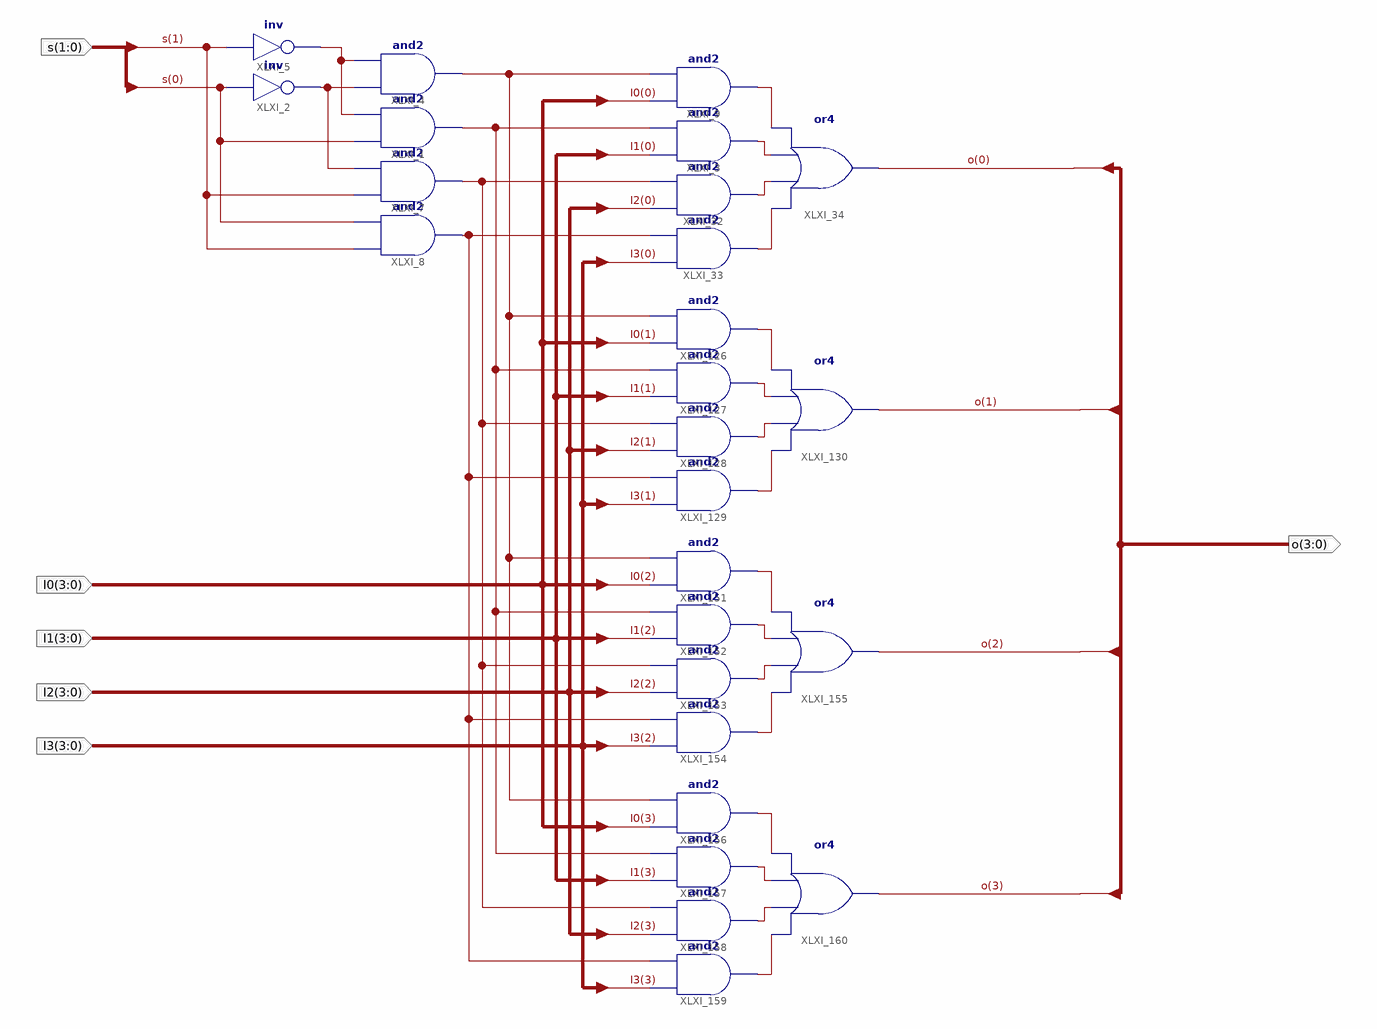
[diagram p0: schematic sheet 1]
// Xilinx ISE schematic MUX441.sch (kintex7) as structural Verilog: 26 symbols, 6 ports
module MUX441 (
  input  [3:0] I2,
  input  [3:0] I0,
  input  [3:0] I1,
  input  [1:0] s,
  input  [3:0] I3,
  output [3:0] o
);

  wire D0, D1, D2, D3, XLXN_40, XLXN_108, XLXN_149, XLXN_150, XLXN_151, XLXN_152, XLXN_390, XLXN_391,
       XLXN_394, XLXN_396, XLXN_440, XLXN_441, XLXN_444, XLXN_446, XLXN_450, XLXN_451, XLXN_454, XLXN_456;

  and XLXI_151 (XLXN_440, I0[2], D0);
  or XLXI_160 (o[3], XLXN_451, XLXN_456, XLXN_454, XLXN_450);
  and XLXI_159 (XLXN_451, I3[3], D3);
  and XLXI_158 (XLXN_456, I2[3], D2);
  and XLXI_157 (XLXN_454, I1[3], D1);
  and XLXI_156 (XLXN_450, I0[3], D0);
  or XLXI_155 (o[2], XLXN_441, XLXN_446, XLXN_444, XLXN_440);
  and XLXI_154 (XLXN_441, I3[2], D3);
  and XLXI_153 (XLXN_446, I2[2], D2);
  and XLXI_152 (XLXN_444, I1[2], D1);
  or XLXI_130 (o[1], XLXN_391, XLXN_396, XLXN_394, XLXN_390);
  and XLXI_129 (XLXN_391, I3[1], D3);
  and XLXI_128 (XLXN_396, I2[1], D2);
  and XLXI_127 (XLXN_394, I1[1], D1);
  and XLXI_126 (XLXN_390, I0[1], D0);
  or XLXI_34 (o[0], XLXN_152, XLXN_151, XLXN_150, XLXN_149);
  and XLXI_33 (XLXN_152, I3[0], D3);
  and XLXI_32 (XLXN_151, I2[0], D2);
  and XLXI_3 (XLXN_150, I1[0], D1);
  and XLXI_9 (XLXN_149, I0[0], D0);
  not XLXI_5 (XLXN_40, s[1]);
  not XLXI_2 (XLXN_108, s[0]);
  and XLXI_8 (D3, s[1], s[0]);
  and XLXI_7 (D2, s[1], XLXN_108);
  and XLXI_1 (D1, s[0], XLXN_40);
  and XLXI_4 (D0, XLXN_108, XLXN_40);
endmodule
